# EAGLE design band-single-feather (EAGLE 8.2.2)
DATABASE: /Users/ingolia/Dropbox/Experiments/turbidostat/nephelometer/circuitry/partsdb.txt
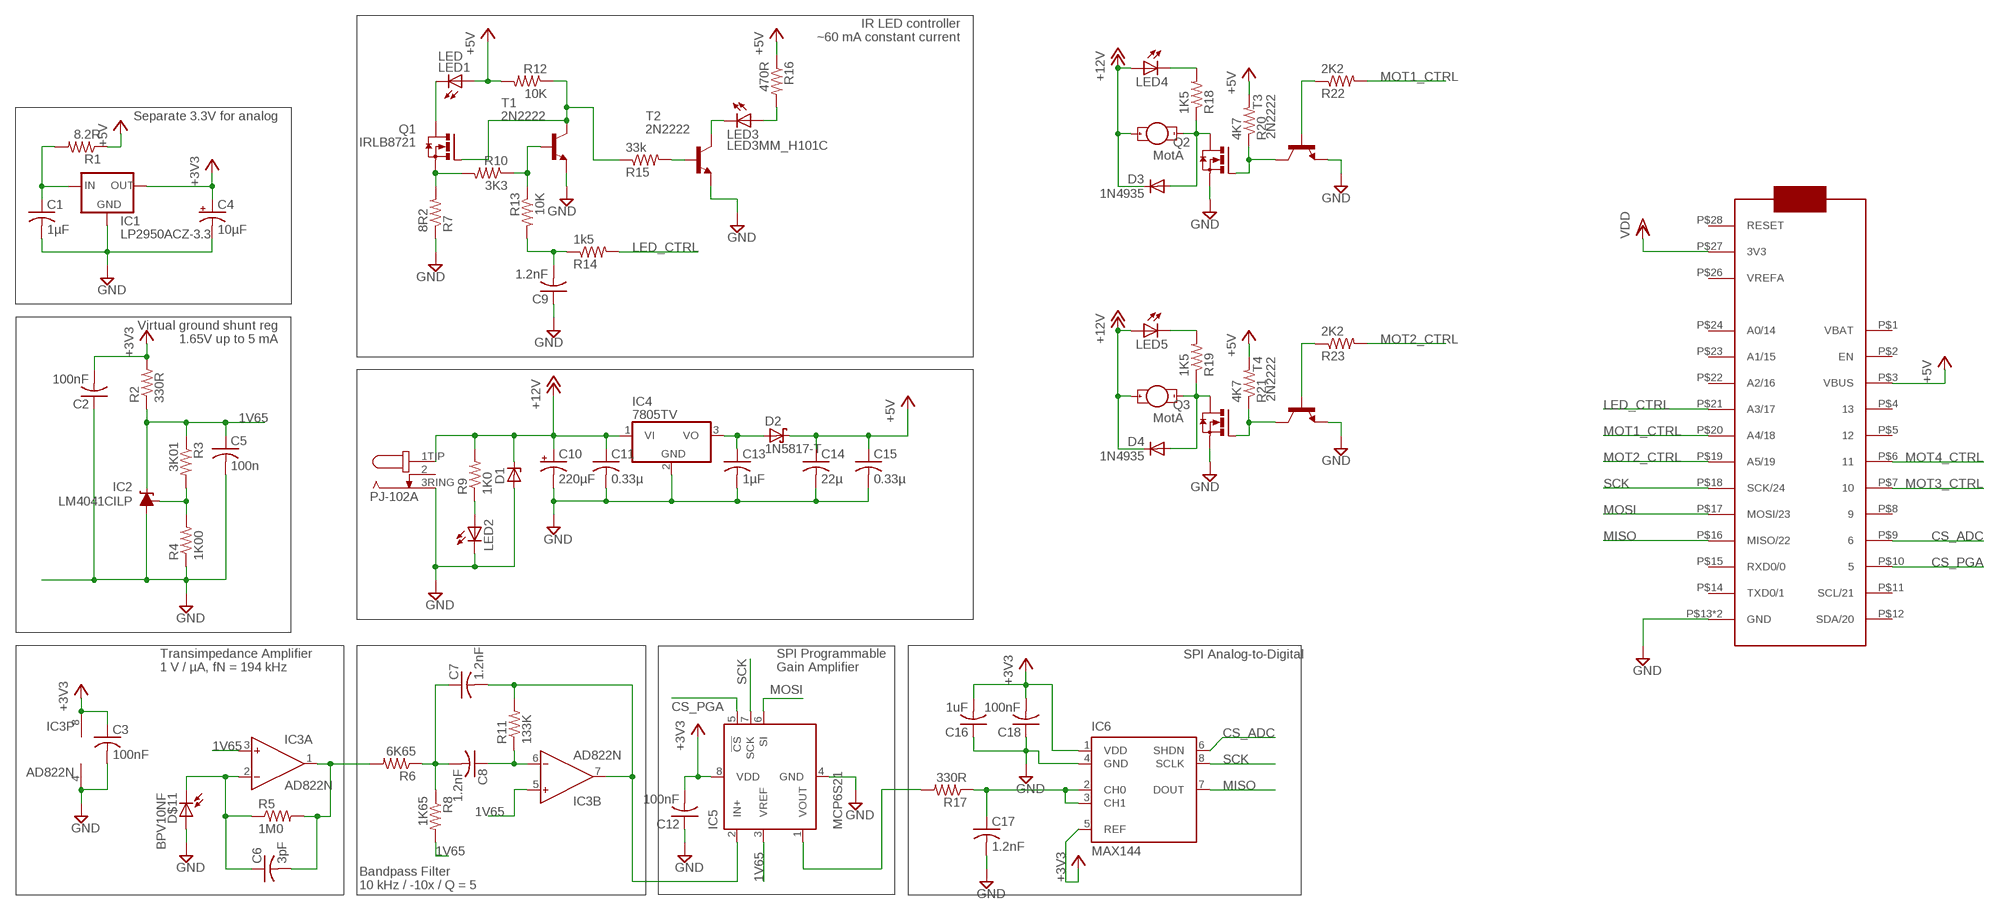
[diagram p0: schematic, sheet 1]

## Parts
C1  1µF  C-US025-030X050  [C025-030X050]
C2  100nF  C-US025-025X050  [C025-025X050]
C3  100nF  C-US025-025X050  [C025-025X050]
C4  10µF  CPOL-USE2.5-5  [E2,5-5]
C5  100n  C-US025-025X050  [C025-025X050]
C6  3pF  C-US025-024X044  [C025-024X044]
C7  1.2nF  C-US025-025X050  [C025-025X050]
C8  1.2nF  C-US025-025X050  [C025-025X050]
C9  1.2nF  C-US025-025X050  [C025-025X050]
C10  220µF  CPOL-USE3.5-8  [E3,5-8]
C11  0.33µ  C-US025-050X050  [C025-050X050]
C12  100nF  C-US025-025X050  [C025-025X050]
C13  1µF  C-US025-030X050  [C025-030X050]
C14  22µ  C-US050-045X075  [C050-045X075]
C15  0.33µ  C-US025-050X050  [C025-050X050]
C16  1uF  C-US025-025X050  [C025-025X050]
C17  1.2nF  C-US025-025X050  [C025-025X050]
C18  100nF  C-US025-025X050  [C025-025X050]
D1  ZENER-DIODEF126-10  [F126Z10]
D2  1N5817-T  [DO41-7.6]
D3  1N4935  1N4004  [DO41-10]
D4  1N4935  1N4004  [DO41-10]
D$11  BPV10NF  [LED5MM]
IC1  LP2950ACZ-3.3  [TO92]
IC2  LM4041CILP  [LP_O-PBCY-W3]
IC3  AD822N  [DIL08]
IC4  7805TV  [TO220V]
IC5  MCP6S21  [DIL08]
IC6  MAX144  [DIL08]
IC7  FEATHER_M0  [FEATHER_M0]
J1  PJ-102A  [PJ-102A]
J2  MotA  1X02_3.5MM_MOT  [1X02_3.5MM_MOT]
J3  MotA  1X02_3.5MM_MOT  [1X02_3.5MM_MOT]
LED1  LED  1X02_3.5MM_LED  [1X02_3.5MM]
LED2  LED5MM  [LED5MM]
LED3  LED3MM_H101C  [LED3MM_H101C]
LED4  LED3MM  [LED3MM]
LED5  LED3MM  [LED3MM]
Q1  IRLB8721  [TO220BV]
Q2  IRLB8721  [TO220BV]
Q3  IRLB8721  [TO220BV]
R1  8.2R  R-US_0207/9  [0207/9]
R2  330R  R-US_0207/9  [0207/9]
R3  3K01  R-US_0207/9  [0207/9]
R4  1K00  R-US_0207/9  [0207/9]
R5  1M0  R-US_0207/9  [0207/9]
R6  6K65  R-US_0207/9  [0207/9]
R7  8R2  R-US_0207/9  [0207/9]
R8  1K65  R-US_0207/9  [0207/9]
R9  1K0  R-US_0207/9  [0207/9]
R10  3K3  R-US_0207/9  [0207/9]
R11  133K  R-US_0207/9  [0207/9]
R12  10K  R-US_0207/9  [0207/9]
R13  10K  R-US_0207/9  [0207/9]
R14  1k5  R-US_0207/9  [0207/9]
R15  33k  R-US_0207/9  [0207/9]
R16  470R  R-US_0207/5V  [0207/5V]
R17  330R  R-US_0207/9  [0207/9]
R18  1K5  R-US_0207/10  [0207/10]
R19  1K5  R-US_0207/10  [0207/10]
R20  4K7  R-US_0207/10  [0207/10]
R21  4K7  R-US_0207/10  [0207/10]
R22  2K2  R-US_0207/10  [0207/10]
R23  2K2  R-US_0207/10  [0207/10]
T1  2N2222  [TO92-EBC-OVAL]
T2  2N2222  [TO92-EBC-OVAL]
T3  2N2222  [TO92-EBC-OVAL]
T4  2N2222  [TO92-EBC-OVAL]

## Nets
1V65: C5.1 IC2.2(C) IC3.3(A:IN+) IC3.5(B:IN+) IC5.3(VREF) R2.1 R3.1 R8.2
+3V3: C2.2 C3.1 C4.+ C12.2 C16.2 C18.2 IC1.1(OUT) IC3.8(P:V+) IC5.8(VDD) IC6.1(VDD) IC6.5(REF) R2.2
+5V: C14.1 C15.1 D2.C IC7.P$3(VBUS) LED1.1A(A) R1.1 R12.2 R16.1 R20.2 R21.2
+12V: C10.+ C11.1 D1.C D3.C D4.C IC4.1(VI) J1.1TIP(3TIP) J2.1A(+) J3.1A(+) LED4.A LED5.A R9.2
BPF: C7.2 IC3.7(B:OUT) IC5.2(IN+) R11.2
CS_ADC: IC6.6(SHDN) IC7.P$9
CS_PGA: IC5.5(!CS) IC7.P$10
FB: C6.1 D$11.K IC3.2(A:IN-) R5.1
GND: C1.2 C2.1 C3.2 C4.- C5.2 C9.1 C10.- C11.2 C12.1 C13.2 C14.2 C15.2 C16.1 C17.2 C18.1 D1.A D$11.A IC1.2(GND) IC2.3(A) IC3.4(P:V-) IC4.2(GND) IC5.4(GND) IC6.4(GND) IC7.P$13(GND) IC7.P$25(GND) J1.3RING(1RING) LED2.K(C) Q2.S Q3.S R4.1 R7.1 T1.E T2.E T3.E T4.E
LED_CTRL: IC7.P$21(A3/17) R14.2
MISO: IC6.7(DOUT) IC7.P$16(MISO/22)
MOSI: IC5.6(SI) IC7.P$17(MOSI/23)
MOT1: Q2.G R20.1 T3.C
MOT1_CTRL: IC7.P$20(A4/18) R22.2
MOT2: Q3.G R21.1 T4.C
MOT2_CTRL: IC7.P$19(A5/19) R23.2
MOT3_CTRL: IC7.P$7
MOT4_CTRL: IC7.P$6
N$1: LED2.A R9.1
N$3: C7.1 C8.2 R6.1 R8.1
N$4: IC5.1(VOUT) R17.2
N$5: D3.A J2.2K(-) Q2.D R18.1
N$6: LED4.K(C) R18.2
N$7: R22.1 T3.B
N$8: Q1.G R12.1 R15.1 T1.C
N$9: C8.1 IC3.6(B:IN-) R11.1
N$10: D4.A J3.2K(-) Q3.D R19.1
N$11: LED3.A R16.2
N$12: LED3.K T2.C
N$13: R10.1 R13.1 T1.B
N$14: Q1.S R7.2 R10.2
N$15: C9.2 R13.2 R14.1
N$16: R15.2 T2.B
N$18: LED1.2K(K) Q1.D
N$19: LED5.K(C) R19.2
N$20: R23.1 T4.B
N$21: C13.1 D2.A IC4.3(VO)
N$23: C17.1 IC6.2(CH0) IC6.3(CH1) R17.1
N$24: C1.1 IC1.3(IN) R1.2
N$35: IC2.1(FB) R3.2 R4.2
SCK: IC5.7(SCK) IC6.8(SCLK) IC7.P$18(SCK/24)
TIA: C6.2 IC3.1(A:OUT) R5.2 R6.2
VDD: IC7.P$27(3V3)
Unconnected: IC7.P$1(VBAT) IC7.P$2(EN) IC7.P$4 IC7.P$5 IC7.P$8 IC7.P$11(SCL/21) IC7.P$12(SDA/20) IC7.P$14(TXD0/1) IC7.P$15(RXD0/0) IC7.P$22(A2/16) IC7.P$23(A1/15) IC7.P$24(A0/14) IC7.P$26(VREFA) IC7.P$28(RESET) J1.2

## Notes on the sheet
- IR LED controller
  ~60 mA constant current
- Separate 3.3V for analog
- Virtual ground shunt reg
  1.65V up to 5 mA
- SPI Analog-to-Digital
- Transimpedance Amplifier
  1 V / µA, fN = 194 kHz
- SPI Programmable
  Gain Amplifier
- Bandpass Filter
  10 kHz / -10x / Q = 5

## Library data of the parts
C1 C13 C16 = adafruit:C-US: CAPACITOR, American symbol; DIGIKEY#: 445-5318-ND; MANF: TDK Corporation; MANF#: FK14X7R1C105K
C2 C3 C5 C12 C18 = adafruit:C-US: CAPACITOR, American symbol; DIGIKEY#: BC1084CT-ND; MANF: Vishay BC Components; MANF#: K104K15X7RF5TL2
C4 = adafruit:CPOL-US: POLARIZED CAPACITOR, American symbol; DIGIKEY#: 478-8042-1-ND; MANF: AVX Corporation; MANF#: TAP106K016SRW
C6 = adafruit:C-US: CAPACITOR, American symbol; DIGIKEY#: 445-8377-ND; MANF: TDK Corporation; MANF#: FK18C0G1H030C
C7-C9 C17 = adafruit:C-US: CAPACITOR, American symbol; DIGIKEY#: BC1026CT-ND; MANF: Vishay BC Components; MANF#: K122J15C0GF5TL2
C10 = adafruit:CPOL-US: POLARIZED CAPACITOR, American symbol; DIGIKEY#: P5166-ND; MANF: Panasonic Electronic Components; MANF#: ECA-1VM221
C11 C15 = adafruit:C-US: CAPACITOR, American symbol; DIGIKEY#: 445-5312-ND; MANF: TDK Corporation; MANF#: FK14X7R1H334K
C14 = adafruit:C-US: CAPACITOR, American symbol; DIGIKEY#: 445-8455-ND; MANF: TDK Corporation; MANF#: FK20X7R1C226M
D1 = diode:ZENER-DIODE: Z-Diode; DIGIKEY#: SA12ALFCT-ND; MANF: Littelfuse Inc.; MANF#: SA12A
D2 = diode:1N581*: 1.0A SCHOTTKY BARRIER RECTIFIER Source: http://www.diodes.com/datasheets/ds23001.pdf; DIGIKEY#: 1N5817FSCT-ND; MANF: Fairchild Semiconductor; MANF#: 1N5817
D3 D4 = adafruit:1N4004: DIODE General purpose 1N400x type rectifier (With bigger pads) http://www.ladyada.net/library/pcb/eaglelibrary.html; DIGIKEY#: 1N4935FSCT-ND; MANF: Fairchild Semiconductor; MANF#: 1N4935
D$11 = ingolia:BPV10NF; DIGIKEY#: 751-1002-ND; MANF: Vishay Semiconductor Opto Division; MANF#: BPV10NF
IC1 = v-reg:LP2950?*: Source: http://cache.national.com/ds/LP/LP2950.pdf; DIGIKEY#: LP2950ACZ-3.3/NOPB-ND; MANF: Texas Instruments; MANF#: LP2950ACZ-3.3/NOPB
IC2 = texas:LM4041*I: PRECISION MICROPOWER SHUNT VOLTAGE REFERENCE Adjustable Output Source: http://focus.ti.com/lit/ds/slcs146e/slcs146e.pdf; DIGIKEY#: 296-22173-1-ND; MANF: Texas Instruments; MANF#: LM4041CILPR; MPN: LM4041CILP; OC_FARNELL: 1673945; OC_NEWARK: 50M8856
IC3 = analog-devices:AD822: Single-Supply, Rail-to-Rail Low Power FET-Input Op Amp Source: http://www.analog.com/static/imported-files/data_sheets/AD822.pdf; DIGIKEY#: AD823ANZ-ND; MANF: Analog Devices Inc.; MANF#: AD823ANZ; OC_FARNELL: 1438581; OC_NEWARK: unknown
IC4 = linear:78*: Positive VOLTAGE REGULATOR Source: http://cache.national.com/ds/LM/LM78L05.pdf http://www.fairchildsemi.com/ds/LM/LM7805.pdf; DIGIKEY#: LM7805CT-ND; MANF: Fairchild Semiconductor; MANF#: LM7805CT
IC5 = ingolia:MCP6S21; DIGIKEY#: MCP6S91-E/P-ND; MANF: Microchip Technology; MANF#: MCP6S91-E/P
IC6 = ingolia:MAX144; DIGIKEY#: MAX144ACPA+-ND; MANF: Maxim Integrated; MANF#: MAX144ACPA+
IC7 = ingolia:FEATHER_M0; DIGIKEY#: 1528-1531-ND; DIGIKEY2#: 2830-ND; DIGIKEY3#: 1528-1560-ND; MANF: Adafruit Industries LLC; MANF#: 2772; MANF2: Adafruit Industries LLC; MANF2#: 2830; MANF3: Adafruit Industries LLC; MANF3#: 2886
J1 = ingolia:PJ-102A; DIGIKEY#: CP-102A-ND; MANF: CUI Inc.; MANF#: PJ-102A
J2 J3 = ingolia:1X02_3.5MM_MOT; DIGIKEY#: ED2740-ND; MANF: On Shore Technology Inc.; MANF#: OSTTE020104
LED1 = ingolia:1X02_3.5MM_LED; DIGIKEY#: 475-3002-ND; DIGIKEY2#: 492-1502-ND; DIGIKEY3#: ED2740-ND; MANF: OSRAM Opto Semiconductors Inc; MANF#: SFH 4547; MANF2: Bivar Inc; MANF2#: CR-174; MANF3: On Shore Technology Inc.; MANF3#: OSTTE020104
LED2 = adafruit:LED: LED OSRAM: - CHIPLED LG R971, LG N971, LY N971, LG Q971, LY Q971, LO R971, LY R971 LH N974, LH R974 LS Q976, LO Q976, LY Q976 LO Q996 - Hyper CHIPLED LW Q18S LB Q993, LB Q99A, LB R99A - SideLED LS A670, LO A670, LY A670, LG A670, LP A670 LB A673, LV A673, LT A673, LW A673 LH A674 LY A675 LS A676, LA A676, LO A676, LY A676, LW A676 LS A679, LY A679, LG A679 - Hyper Micro SIDELED® LS Y876, LA Y876, LO Y876, LY Y876 LT Y87S - SmartLED LW L88C, LW L88S LB L89C, LB L89S, LG L890 LS L89K, LO L89K, LY L89K LS L896, LA L896, LO L896, LY L896 - TOPLED LS T670, LO T670, LY T670, LG T670, LP T670 LSG T670, LSP T670, LSY T670, LOP T670, LYG T670 LG T671, LOG T671, LSG T671 LB T673, LV T673, LT T673, LW T673 LH T674 LS T676, LA T676, LO T676, LY T676, LB T676, LH T676, LSB T676, LW T676 LB T67C, LV T67C, LT T67C, LS T67K, LO T67K, LY T67K, LW E67C LS E67B, LA E67B, LO E67B, LY E67B, LB E67C, LV E67C, LT E67C LW T67C LS T679, LY T679, LG T679 LS T770, LO T770, LY T770, LG T770, LP T770 LB T773, LV T773, LT T773, LW T773 LH T774 LS E675, LA E675, LY E675, LS T675 LS T776, LA T776, LO T776, LY T776, LB T776 LHGB T686 LT T68C, LB T68C - Hyper Mini TOPLED® LB M676 - Mini TOPLED Santana® LG M470 LS M47K, LO M47K, LY M47K Source: http://www.osram.convergy.de/; DIGIKEY#: 754-1735-ND; MANF: Kingbright; MANF#: WP7113SGD
LED3 = ingolia:LED3MM_H101C; DIGIKEY#: 754-1727-ND; DIGIKEY2#: 492-1789-ND; MANF: Kingbright; MANF#: WP710A10SYD; MANF2: Bivar Inc.; MANF2#: H-101C
LED4 LED5 = adafruit:LED: LED OSRAM: - CHIPLED LG R971, LG N971, LY N971, LG Q971, LY Q971, LO R971, LY R971 LH N974, LH R974 LS Q976, LO Q976, LY Q976 LO Q996 - Hyper CHIPLED LW Q18S LB Q993, LB Q99A, LB R99A - SideLED LS A670, LO A670, LY A670, LG A670, LP A670 LB A673, LV A673, LT A673, LW A673 LH A674 LY A675 LS A676, LA A676, LO A676, LY A676, LW A676 LS A679, LY A679, LG A679 - Hyper Micro SIDELED® LS Y876, LA Y876, LO Y876, LY Y876 LT Y87S - SmartLED LW L88C, LW L88S LB L89C, LB L89S, LG L890 LS L89K, LO L89K, LY L89K LS L896, LA L896, LO L896, LY L896 - TOPLED LS T670, LO T670, LY T670, LG T670, LP T670 LSG T670, LSP T670, LSY T670, LOP T670, LYG T670 LG T671, LOG T671, LSG T671 LB T673, LV T673, LT T673, LW T673 LH T674 LS T676, LA T676, LO T676, LY T676, LB T676, LH T676, LSB T676, LW T676 LB T67C, LV T67C, LT T67C, LS T67K, LO T67K, LY T67K, LW E67C LS E67B, LA E67B, LO E67B, LY E67B, LB E67C, LV E67C, LT E67C LW T67C LS T679, LY T679, LG T679 LS T770, LO T770, LY T770, LG T770, LP T770 LB T773, LV T773, LT T773, LW T773 LH T774 LS E675, LA E675, LY E675, LS T675 LS T776, LA T776, LO T776, LY T776, LB T776 LHGB T686 LT T68C, LB T68C - Hyper Mini TOPLED® LB M676 - Mini TOPLED Santana® LG M470 LS M47K, LO M47K, LY M47K Source: http://www.osram.convergy.de/; DIGIKEY#: 754-1275-ND; MANF: Kingbright; MANF#: WP7113SRD/D
Q1 = ingolia:IRLB8721; DIGIKEY#: IRLB8721PBF-ND; MANF: Infineon Technologies; MANF#: IRLB8721PBF
Q2 Q3 = ingolia:IRLB8721; DIGIKEY#: IRLB8721PBF-ND; MANF: International Rectifier; MANF#: IRLB8721PBF
R1 R7 = adafruit:R-US_: RESISTOR, American symbol; DIGIKEY#: S8.2HCT-ND; MANF: Stackpole Electronics Inc.; MANF#: CFM12JT8R20
R2 = adafruit:R-US_: RESISTOR, American symbol; DIGIKEY#: CF14JT330RCT-ND; MANF: Stackpole Electronics Inc.; MANF#: CF14JT330R
R3 = adafruit:R-US_: RESISTOR, American symbol; DIGIKEY#: RNF14FTD3K01CT-ND; MANF: Stackpole Electronics Inc.; MANF#: RNF14FTD3K01
R4 = adafruit:R-US_: RESISTOR, American symbol; DIGIKEY#: RNF14FTD1K00CT-ND; MANF: Stackpole Electronics Inc.; MANF#: RNF14FTD1K00
R5 = adafruit:R-US_: RESISTOR, American symbol; DIGIKEY#: RNV14FAL1M00CT-ND; MANF: Stackpole Electronics Inc; MANF#: RNV14FAL1M00
R6 = adafruit:R-US_: RESISTOR, American symbol; DIGIKEY#: 6.65KXBK-ND; MANF: Yageo; MANF#: MFR-25FBF52-6K65
R8 = adafruit:R-US_: RESISTOR, American symbol; DIGIKEY#: 1.65KXBK-ND; MANF: Yageo; MANF#: MFR-25FBF52-1K65
R9 = adafruit:R-US_: RESISTOR, American symbol; DIGIKEY#: S1KHCT-ND; MANF: Stackpole Electronics Inc.; MANF#: CFM12JT1K00
R10 = adafruit:R-US_: RESISTOR, American symbol; DIGIKEY#: CF14JT3K30CT-ND; MANF: Stackpole Electronics Inc; MANF#: CF14JT3K30
R11 = adafruit:R-US_: RESISTOR, American symbol; DIGIKEY#: 133KXBK-ND; MANF: Yageo; MANF#: MFR-25FBF52-133K
R12 R13 = adafruit:R-US_: RESISTOR, American symbol; DIGIKEY#: CF14JT10K0CT-ND; MANF: Stackpole Electronics Inc; MANF#: CF14JT10K0
R14 = adafruit:R-US_: RESISTOR, American symbol; DIGIKEY#: CF14JT1K50CT-ND; MANF: Stackpole Electronics Inc; MANF#: CF14JT1K50
R15 = adafruit:R-US_: RESISTOR, American symbol; DIGIKEY#: CF14JT33K0CT-ND; MANF: Stackpole Electronics Inc; MANF#: CF14JT33K0
R16 = adafruit:R-US_: RESISTOR, American symbol; DIGIKEY#: CF14JT470RCT-ND; MANF: Stackpole Electronics Inc.; MANF#: CF14JT470R
R17 = adafruit:R-US_: RESISTOR, American symbol; DIGIKEY#: S330CACT-ND; MANF: Stackpole Electronics Inc.; MANF#: RNMF14FTC330R
R18 R19 = adafruit:R-US_: RESISTOR, American symbol; DIGIKEY#: CF14JT1K50CT-ND; MANF: Stackpole Electronics Inc; MANF#: CF14JT330R
R20 R21 = adafruit:R-US_: RESISTOR, American symbol; DIGIKEY#: CF14JT4K70CT-ND; MANF: Stackpole Electronics Inc; MANF#: CF14JT4K70
R22 R23 = adafruit:R-US_: RESISTOR, American symbol; DIGIKEY#: CF14JT2K20CT-ND; MANF: Stackpole Electronics Inc; MANF#: CF14JT2K20
T1-T4 = adafruit:2N2222: NPN TRANSISTOR Big oval pads; DIGIKEY#: PN2222ATFCT-ND; MANF: Fairchild Semiconductor; MANF#: PN2222ATF

## Board
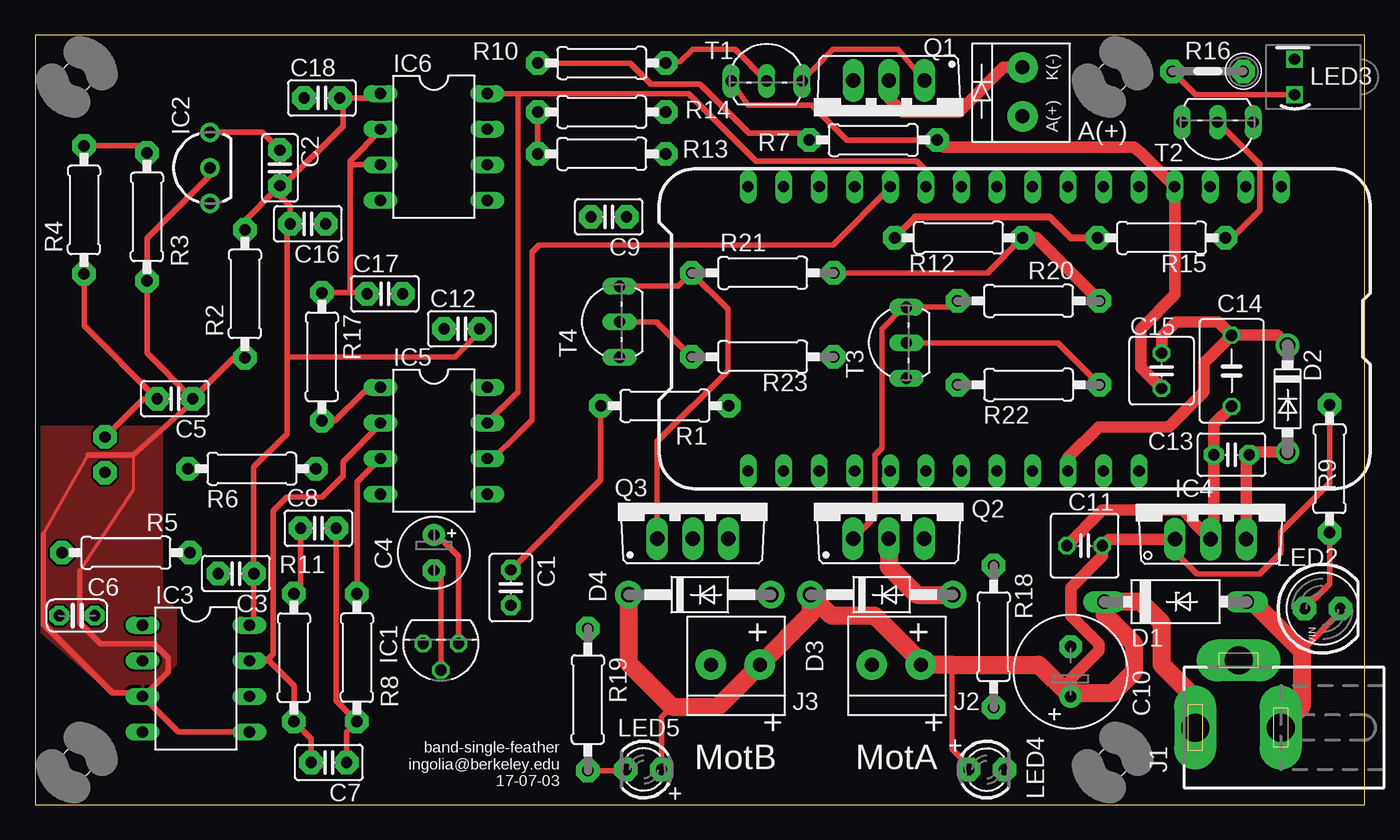
[diagram p1: board, top side]
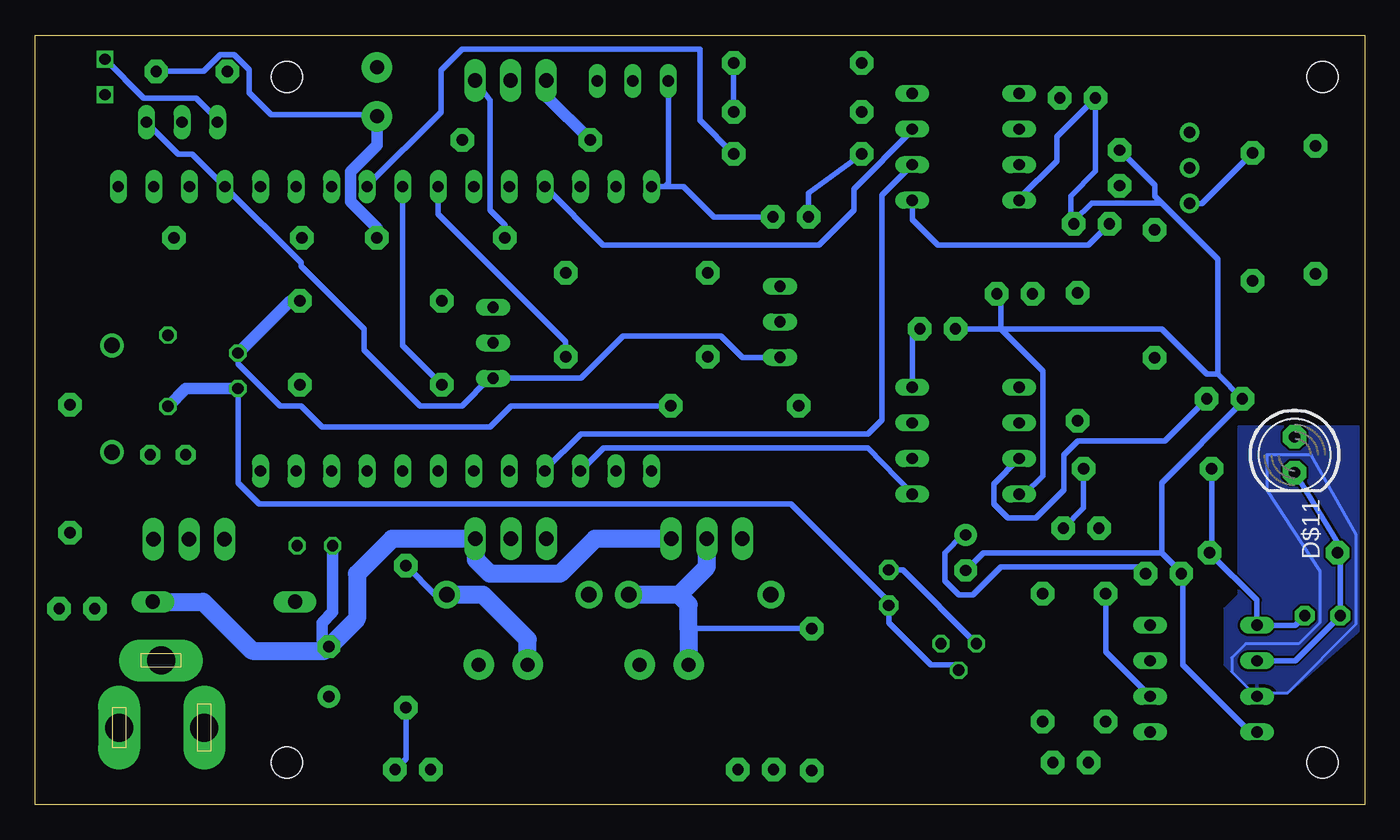
[diagram p2: board, bottom side, seen from below]

Size 95 x 55 mm. Coordinates in mm from the lower left corner, seen from the top.
Outline: 0,0 95,0 95,55 0,55 0,0
Copper layers (1*16): Top 0.0356mm / dielectric 1.5011mm / Bottom 0.0356mm
Design rules "oshpark-2layer": minimum track width 6mil, minimum drill 13mil, track to track 6mil, track to pad 6mil, pad to pad 6mil, via to via 6mil, smd to smd 6mil, copper to edge 15mil, drill to drill 6mil, minimum pad ring 7mil, minimum via ring 7mil, stop-mask expansion 2.5mil, vias tented up to drill 0mil, thermal gap 10mil

### Footprints (pad centres in the part's own frame; a part is rotated, then mirrored left to right if it is on the bottom)
C025-030X050 = drill 0.813 pad 1.422 octagon: 1 -1.27,0; 2 1.27,0
C025-025X050 = drill 0.813 pad 1.676 octagon: 1 -1.27,0; 2 1.27,0
E2,5-5 = drill 0.813 pad 1.6: + -1.27,0 | drill 0.813 pad 1.6 octagon: - 1.27,0
C025-024X044 = drill 0.813 pad 1.422 octagon: 1 -1.27,0; 2 1.27,0
E3,5-8 = drill 0.813 pad 1.6: + -1.778,0 | drill 0.813 pad 1.6 octagon: - 1.778,0
C025-050X050 = drill 0.813 octagon: 1 -1.27,0; 2 1.27,0
C050-045X075 = drill 0.813 octagon: 1 -2.54,0; 2 2.54,0
F126Z10 = drill 1.016 long: A 5.08,0; C -5.08,0
DO41-7.6 = drill 1.1 pad 1.7: A 3.81,0; C -3.81,0
DO41-10 = drill 1.118 pad 1.93: A 5.08,0; C -5.08,0
LED5MM = drill 0.813 pad 1.676 octagon: A -1.27,0; K 1.27,0
TO92 = drill 0.813 octagon: 1 -1.27,0; 2 0,1.905; 3 1.27,0
LP_O-PBCY-W3 = drill 0.8 pad 1.4: 1 -2.54,0; 2 0,0; 3 2.54,0
DIL08 = drill 0.813 long: 1 -3.81,-3.81; 2 -1.27,-3.81; 3 1.27,-3.81; 4 3.81,-3.81; 5 3.81,3.81; 6 1.27,3.81; 7 -1.27,3.81; 8 -3.81,3.81
TO220V = drill 1.016 long: 1 -2.54,-2.54; 2 0,-2.54; 3 2.54,-2.54
FEATHER_M0 = drill 0.8 long: P$1 -8.89,10.16; P$2 -6.35,10.16; P$3 -3.81,10.16; P$4 -1.27,10.16; P$5 1.27,10.16; P$6 3.81,10.16; P$7 6.35,10.16; P$8 8.89,10.16; P$9 11.43,10.16; P$10 13.97,10.16; P$11 16.51,10.16; P$12 19.05,10.16; P$13 19.05,-10.16; P$14 16.51,-10.16; P$15 13.97,-10.16; P$16 11.43,-10.16; P$17 8.89,-10.16; P$18 6.35,-10.16; P$19 3.81,-10.16; P$20 1.27,-10.16; P$21 -1.27,-10.16; P$22 -3.81,-10.16; P$23 -6.35,-10.16; P$24 -8.89,-10.16; P$25 -11.43,-10.16; P$26 -13.97,-10.16; P$27 -16.51,-10.16; P$28 -19.05,-10.16
PJ-102A = drill 2 pad 2.54 long: 1TIP 0,3.1; 2 4.8,0; 3RING 0,-3
1X02_3.5MM_MOT = drill 1 pad 2.184: 1A 1.8,0; 2K -1.7,0
1X02_3.5MM = drill 1 pad 2.184: 1A 1.8,0; 2K -1.7,0
LED3MM_H101C = drill 0.8 square: A 1.27,0; K -1.27,0
LED3MM = drill 0.813 pad 1.676 octagon: A -1.27,0; K 1.27,0
TO220BV = drill 1.016 long: D 0,0; G -2.54,0; S 2.54,0
0207/9 = drill 0.813 pad 1.676 octagon: 1 -4.572,0; 2 4.572,0
0207/5V = drill 0.813 pad 1.676 octagon: 1 -2.54,0; 2 2.54,0
0207/10 = drill 0.813 pad 1.676 octagon: 1 -5.08,0; 2 5.08,0
TO92-EBC-OVAL = drill 0.813 long: B 0,-1.27; C 2.54,-1.27; E -2.54,-1.27
M2MOUNT = hole 2.2: 0,0

### Placement (x,y rotation side)
C1  34,15.5 270 top
C2  17.5,45.5 270 top
C3  14.36,16.51 180 top
C4  28.5,18 270 top
C5  10,29 180 top
C6  3,13.5 0 top
C7  21,3 180 top
C8  20.25,19.75 0 top
C9  41,42 180 top
C10  74,9.5 90 top
C11  75,18.5 180 top
C12  30.5,34 0 top
C13  85.5,25 180 top
C14  85.5,31 270 top
C15  80.5,31 270 top
C16  19.5,41.5 180 top
C17  25,36.5 0 top
C18  20.5,50.5 0 top
D1  81.5,14.5 0 top
D2  89.5,29 270 top
D3  60.5,15 0 top
D4  47.5,15 0 top
D$11  5,25 270 bottom
IC1  29,11.5 180 top
IC2  12.5,45.5 90 top
IC3  11.5,9 270 top
IC4  84,21.5 0 top
IC5  28.5,26 270 top
IC6  28.5,47 270 top
IC7  70,34 180 top
J1  86,5.5 90 top
J2  61.5,10 0 top
J3  50,10 0 top
LED1  70.56,50.98 270 top
LED2  92,14 0 top
LED3  90,52 270 top
LED4  68,2.5 0 top
LED5  43.5,2.5 180 top
Q1  61.01,51.75 180 top
Q2  61,19 0 top
Q3  47,19 0 top
R1  45,28.5 180 top
R2  15,36.5 90 top
R3  8,42 90 top
R4  3.5,42.5 90 top
R5  6.5,18 0 top
R6  15.5,24 180 top
R7  59.89,47.49 180 top
R8  23,10.5 90 top
R9  92.5,24 90 top
R10  40.5,53 180 top
R11  18.5,10.5 270 top
R12  65.99,40.51 0 top
R13  40.5,49.5 180 top
R14  40.5,46.5 0 top
R15  80.5,40.5 0 top
R16  83.8,52.4 180 top
R17  20.5,32 270 top
R18  68.5,12 270 top
R19  39.5,7.5 270 top
R20  71,36 0 top
R21  52,38 0 top
R22  71,30 180 top
R23  52,32 0 top
T1  52.28,52.98 0 top
T2  84.5,47.5 180 top
T3  61,33 90 top
T4  40.5,34.5 90 top
U$1  [M2MOUNT]  3,3 0 top
U$2  [M2MOUNT]  77,52 0 top
U$3  [M2MOUNT]  77,3 0 top
U$4  [M2MOUNT]  3,52 0 top

### Tracks (layer width: path | path; a pad name or v marks a point on that pad's centre or on a via)
1V65
  Top 0.203: 0.6,19.3 3.8,25 | 7,25 7,22.5 3.2,16.7
  Top 0.406: 3.8,25 7,25 11.27,28.77 C5.1 | 3.2,16.7 3.2,13 4.7,11.5 8.5,11.5 9.5,10.5 9.5,9.5 8,8 5.5,8 0.6,12.9 0.6,19.3 | IC3.5 10.23,5.19 IC3.3 | R8.2 23,23.04 IC5.3 | IC2.2 12.5,45 8,40.5 R3.1 8,32.27 C5.1 | R2.1 14.2,31.93 C5.1
  Bottom 0.203: 7,25 7,22.5 3.2,16.7 3.2,13 4.7,11.5 8.5,11.5 9.5,10.5 9.5,9.5 8,8 5.5,8 0.6,12.9 0.6,19.3 3.8,25 7,25
  Bottom 0.406: IC5.3 26.5,22.92 26.5,21.5 25.5,20.5 23.5,20.5 21.5,22.5 21.5,25 20.5,26 14.27,26 C5.1
  pour Top: 0.2,12.6 0.3,27 9,27 9,15 10,14 10,10 8,8 5.5,8
  pour Bottom: 0.2,12.6 0.3,27 9,27 9,15 10,14 10,10 8,8 5.5,8
+3V3
  Top 0.406: R2.2 15,41.73 17.14,43.87 | 17.14,43.87 C2.2 | 17.73,44 C2.2 | IC6.1 24.38,50.5 C18.2 22,50.27 22,48.5 17.73,44.23 C2.2 | IC3.8 15.63,13.13 C3.1 15.63,24.13 18,26.5 18,32 | IC1.1 30.27,17.73 29,19 28.77,19 C4.+ | 17.14,43.87 18.23,42.77 C16.2 18,41.27 18,32 | C12.2 31.77,33.77 30,32 18,32
  Bottom 0.406: IC5.8 32.31,33.46 C12.2 | C4.+ 28.73,19.27 30,18 30,16 29,15 28,15 26,17 16.12,17 C3.1 | IC6.5 32.31,41.81 30.5,40 19.73,40 C16.2
+5V
  Top 0.406: R21.2 68.05,38 R12.2
  Top 0.813: R12.2 71.57,40.51 R20.2 76.08,35.92 | IC7.P$3 73.81,24.81 76,27 81,27 83.5,29.5 83.5,31.54 C14.1 | C14.1 88.77,33.54 D2.C | C15.1 80.5,33.5 81.5,34.5 84.54,34.5 C14.1
  Bottom 0.406: R16.1 82.95,52.4 81.75,53.59 80.77,53.59 79.7,52.53 79.7,50.88 78.12,49.3 70.68,49.3 LED1.1A | R1.1 61,28.5 62.5,27 74.5,27 76,28.5 77.5,28.5 80.5,31.5 C15.1
  Bottom 0.813: LED1.1A 70.56,47.11 72.43,45.24 72.43,43.08 70.56,41.21 R12.2 | R20.2 76.77,36 C15.1
+12V
  Top 0.406: LED5.A 44.77,6.27 45.5,7 | LED4.A 66.73,2.77 65.5,4 65.5,10 | R9.2 92.5,23 89,19.5 89,18 87.5,16.5 83,16.5 81.5,18 81.5,18.92 IC4.1
  Top 0.813: 76.27,14.65 D1.C | IC4.1 76.73,18.96 C11.1 76.27,17.77 74,15.5 74,13.5 76,11.5 76,11 74,9 74,8.28 74.28,8
  Top 1.27: D4.C 42.42,10.08 45.5,7 48.8,7 J3.1A 55.42,13.62 D3.C 56.92,13.5 60,13.5 63,10.5 J2.1A 65.5,10 71.72,10 C10.+ 74.28,8 77,8 78.5,9.5 78.5,11.5 76.42,13.58 D1.C 79,14.5 80.5,13 80.5,10 82.9,7.6 J1.1TIP
BPF
  Top 0.406: IC3.7 16.5,10.27 | 16.5,10.27 16.73,10.27 18.5,8.5 R11.2 19.73,4.7 C7.2 | IC5.2 24.69,27.19 22,24.5 22,23.5 20.5,22 18,22 17,21 17,10.77 16.5,10.27
CS_ADC
  Bottom 0.406: IC7.P$9 58.57,23.93 56,26.5 35.5,26.5 34.5,27.5 34.5,43.54 IC6.6
CS_PGA
  Bottom 0.406: IC5.5 35.5,25.5 54.37,25.5 IC7.P$10
FB
  Bottom 0.406: D$11.K 1.86,18.59 1.86,18.07 R5.1 1.73,17.94 C6.1 4.96,10.27 IC3.2
GND
  Top 0.406: D$11.A 7.73,29 C5.2 3.5,34.23 R4.1 | IC2.3 16.23,48.04 C2.1 | IC1.2 29,16.23 C4.- | R7.1 58.01,47.49 55.5,50 50.95,50 T1.E | LED2.K 93.27,13.77 90.5,11
  Top 0.813: R7.1 64.95,47 78.5,47 79,46.59 IC7.P$25 81.43,36.43 79,34 79,31.23 C15.2 | C11.2 76.27,21.04 82.01,21.04 82.78,20.27 82.78,20.18 IC4.2 84.23,19.19 C13.2 84.23,27.19 C14.2
  Top 1.27: D1.A 87,14.5 90.5,11 90.5,7 J1.3RING
  Bottom 0.406: T2.E 84.77,46.5 83.77,46.5 IC7.P$25 76,38.73 76,38.5 71.5,34 71.5,32.5 67.5,28.5 64.5,28.5 62.54,30.46 T3.E 62.23,30.5 56,30.5 53,33.5 46,33.5 44.46,31.96 T4.E | IC3.4 8.19,5.19 13,10 13,16.42 C3.2 13.09,16.59 14.5,18 | 28.28,16.51 C4.- 27.23,18 14.5,18 | 14.5,18 14.5,23 8.73,28.77 C5.2 10.5,30.77 | IC6.4 24.69,43.31 22,46 22,47.73 C18.1 19.23,45.27 21,43.5 21,41.73 C16.1 20.77,41.73 19.5,43 14.5,43 | 14.5,43 10.5,39 10.5,30.77 | 14.5,43 15,43.5 15,44.27 C2.1 | IC5.4 24.31,22.19 23,23.5 23,31 26,34 | 26,34 26,36.23 C17.2 | 26,34 C12.1 | 10.5,30.77 11.27,30.77 14.5,34 26,34 | C9.1 46.5,42 48.66,44.16 50,44.16 | 50,44.16 IC7.P$13 | T1.E 49.74,44.42 50,44.16 | IC1.2 29.41,10 31,10 34,13 C1.2 34,14.5 41,21.5 79,21.5 80.5,23 C15.2
  Bottom 0.813: C11.2 73.73,13.77 74.5,13 74.5,11.78 C10.- | C15.2 84.23,29.73 C14.2
  Bottom 1.27: Q3.S 55,19 57.5,16.5 62.5,16.5 63.5,17.5 63.5,18.96 Q2.S 69.5,19 72,16.5 72,13.28 C10.- 74.28,11 79.5,11 83,14.5 D1.A
LED_CTRL
  Bottom 0.406: IC7.P$21 71.27,44.23 66,49.5 66,52.5 64.5,54 47.5,54 47.5,48.93 R14.2
MISO
  Bottom 0.406: IC6.7 32.31,48.19 36.5,44 36.5,42.5 39,40 54.41,40 IC7.P$16
MOSI
  Top 0.406: IC5.6 32.73,24.73 34.5,26.5 | 34.5,26.5 35,27 | IC7.P$17 61.11,44.11 57,40 36,40 35.5,39.5 35.5,27.5 34.5,26.5
MOT1
  Top 0.406: R20.1 65.46,35.54 T3.C 62.04,35.54 60.5,34 60.5,25.5 60,25 60,20.54 Q2.G
MOT1_CTRL
  Bottom 0.406: IC7.P$20 68.73,32.81 R22.2
MOT2
  Top 0.406: T4.C 45.96,37.04 R21.1 49.5,35.42 49.5,31 44.46,25.96 Q3.G
MOT2_CTRL
  Bottom 0.406: R23.2 57.08,33.08 66.19,42.19 IC7.P$19
N$1
  Top 0.406: R9.1 92.5,15.77 LED2.A
N$3
  Top 0.406: C7.1 22.27,5.2 R8.1 21.52,7.41 C8.2
  Bottom 0.406: R6.1 20.07,21.2 C8.2
N$4
  Top 0.406: R17.2 21.43,27.43 23.5,29.5 24.38,29.5 IC5.1
N$5
  Top 1.27: Q2.D 61,17 63,15 D3.A
  Bottom 0.406: D3.A 66.42,15 R18.1
  Bottom 1.27: J2.2K 59.8,11.8 63,15 D3.A
N$6
  Bottom 0.406: R18.2 68.5,3.27 LED4.K
N$7
  Top 0.406: T3.B 73.08,33 R22.1
N$8
  Top 0.406: Q1.G 61.66,54 57,54 54.79,51.71 T1.C
  Top 0.508: R15.1 74,40.5 72.5,42 62.91,42 R12.1
  Bottom 0.406: R12.1 61.42,41.42 62.5,42.5 62.5,50.35 Q1.G
N$9
  Top 0.406: C8.1 18.98,15.55 R11.1
  Bottom 0.406: IC3.6 18.5,10.92 R11.1
N$10
  Bottom 0.406: R19.1 48.22,12.58 48.3,12.5
  Bottom 1.27: 49,15 D4.A | 49,15 47,17 Q3.D | J3.2K 48.3,12.5 48.3,14.3 49,15
N$11
  Top 0.406: LED3.A 82.93,50.73 R16.2
N$12
  Bottom 0.406: T2.C 81.96,48.96 83.5,50.5 87.23,50.5 LED3.K
N$13
  Top 0.406: R10.1 46.07,53.07 47,54 50,54 T1.B
  Bottom 0.406: R13.1 R10.1
N$14
  Top 0.406: R10.2 42.5,53 44,51.5 47.5,51.5 51,48 54.81,48 R7.2
  Bottom 0.813: Q1.S 58.47,50.64 R7.2
N$15
  Top 0.406: R13.2 R14.1
  Bottom 0.406: C9.2 39.73,43.7 R14.1
N$16
  Top 0.406: R15.2 85.5,40.5 87.5,42.5 87.5,45.77 T2.B
N$18
  Top 0.813: LED1.2K 69.18,52.68 66,49.5 62,49.5 61.01,50.49 Q1.D
N$19
  Top 0.406: R19.2 42.15,2.42 LED5.K
N$20
  Top 0.406: T4.B 44.42,34.5 R23.1
N$21
  Top 0.813: D2.A 86.96,25.19 C13.1 86.54,24.77 IC4.3
N$23
  Top 0.406: R17.1 22.5,36.57 | 22.5,36.57 23.66,36.57 C17.1 | IC6.2 24.69,48.19 22.5,46 22.5,45.5 | 22.5,45.5 22.5,36.57 | IC6.3 22.73,45.73 22.5,45.5
N$24
  Top 0.406: R1.2 40.43,23.2 C1.1
  Bottom 0.406: 27.5,11.27 IC1.3 33,16.77 C1.1
N$35
  Top 0.406: R4.2 7.5,47.07 R3.2
  Bottom 0.406: IC2.1 11.61,42.96 R3.2
SCK
  Top 0.406: IC5.7 32.31,27.31 34.5,29.5 34.5,50.8 | 34.5,50.8 34.5,50.82 IC6.8 | IC7.P$18 63.65,45.35 63,46 51.5,46 46.7,50.8 34.5,50.8
  Bottom 0.406: IC7.P$18
TIA
  Bottom 0.406: C6.2 4.96,12.81 IC3.1 7.69,14.62 R5.2 | R5.2 | R6.2 10.93,18.14 R5.2

### Text on the board
tPlace: A(+) | VIN | band-single-feather / ingolia@berkeley.edu / 17-07-03 | + | + | MotB | MotA